# EAGLE design stepper_fw_bw_w_input_control (EAGLE 6.4)
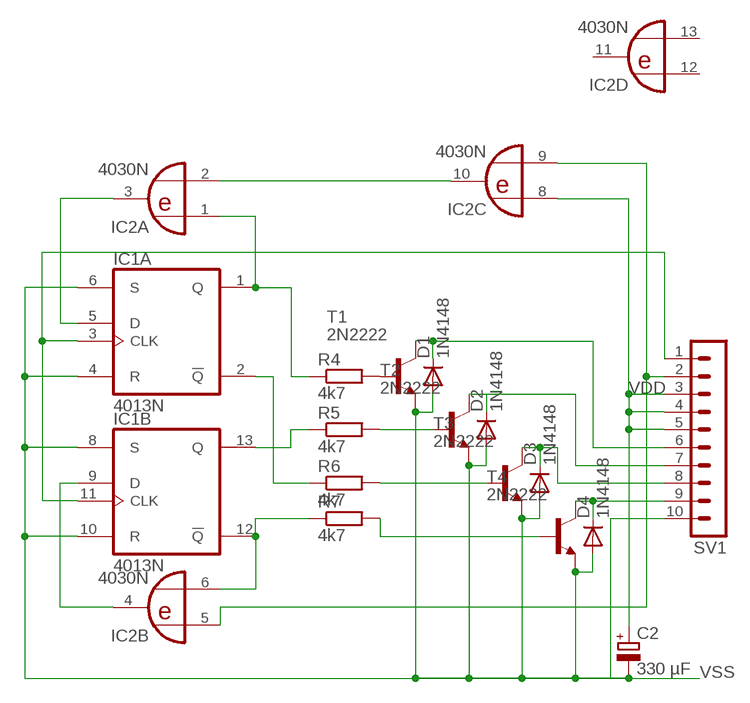
[diagram p0: schematic, sheet 1]

## Parts
C2  330 µF  CPOL-EUE2.5-5  [E2,5-5]
D1  1N4148  DIODE-D-2.5  [D-2.5]
D2  1N4148  DIODE-D-2.5  [D-2.5]
D3  1N4148  DIODE-D-2.5  [D-2.5]
D4  1N4148  DIODE-D-2.5  [D-2.5]
IC1  4013N  [DIL14]
IC2  4030N  [DIL14]
R4  4k7  R-EU_0207/10  [0207/10]
R5  4k7  R-EU_0207/10  [0207/10]
R6  4k7  R-EU_0207/10  [0207/10]
R7  4k7  R-EU_0207/10  [0207/10]
SV1  MA10-1  [MA10-1]
T1  2N2222  [TO18]
T2  2N2222  [TO18]
T3  2N2222  [TO18]
T4  2N2222  [TO18]

## Nets
A1: D2.C SV1.7 T2.3(C)
A2: D1.C SV1.6 T1.3(C)
A3: D3.C SV1.8 T3.3(C)
A4: D4.C SV1.9 T4.3(C)
DIRECTION: IC2.5(B:I0) IC2.9(C:I1) SV1.2
N$1: IC1.1(A:Q) IC2.1(A:I0) R4.1
N$2: IC2.2(A:I1) IC2.10(C:O)
N$3: IC1.2(A:!Q) R6.1
N$4: IC1.5(A:D) IC2.3(A:O)
N$5: IC1.9(B:D) IC2.4(B:O)
N$6: IC1.12(B:!Q) IC2.6(B:I1) R7.1
N$8: IC1.13(B:Q) R5.1
N$9: R4.2 T1.2(B)
N$10: R5.2 T2.2(B)
N$11: R6.2 T3.2(B)
N$12: R7.2 T4.2(B)
TACT: IC1.3(A:CLK) IC1.11(B:CLK) SV1.1
VDD: C2.+ IC2.8(C:I0) SV1.3 SV1.4 SV1.5
VSS: C2.- D1.A D2.A D3.A D4.A IC1.4(A:R) IC1.6(A:S) IC1.8(B:S) IC1.10(B:R) SV1.10 T1.1(E) T2.1(E) T3.1(E) T4.1(E)
Unconnected: IC2.11(D:O) IC2.12(D:I0) IC2.13(D:I1)

## Power pins joined to a net without a drawn wire
VDD: IC1.14(P:VDD) IC2.14(P:VDD)
VSS: IC1.7(P:VSS) IC2.7(P:VSS)

## Library data of the parts
C2 = rcl:CPOL-EU: POLARIZED CAPACITOR, European symbol
D1-D4 = diode:DIODE-: DIODE
IC1 = 40xx:4013: Dual D FLIP FLOP, set/reset
IC2 = 40xx:4030: Quad XOR
R4-R7 = rcl:R-EU_: RESISTOR, European symbol
SV1 = con-lstb:MA10-1: PIN HEADER; OC_FARNELL: unknown; OC_NEWARK: unknown
T1-T4 = transistor:2N2222: NPN TRANSISTOR

## Board
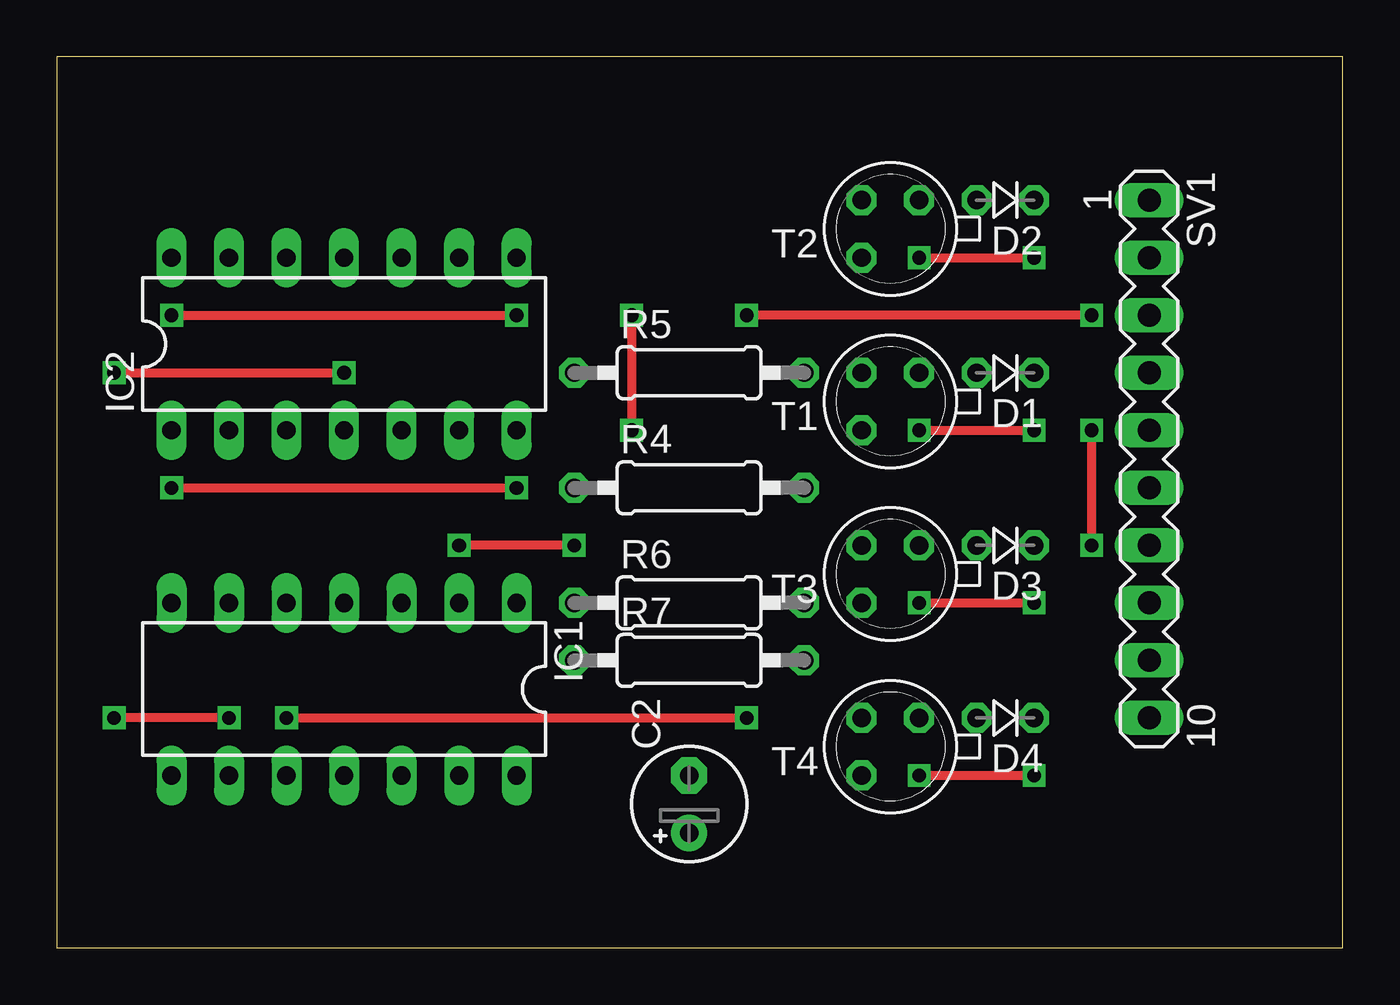
[diagram p1: board, top side]
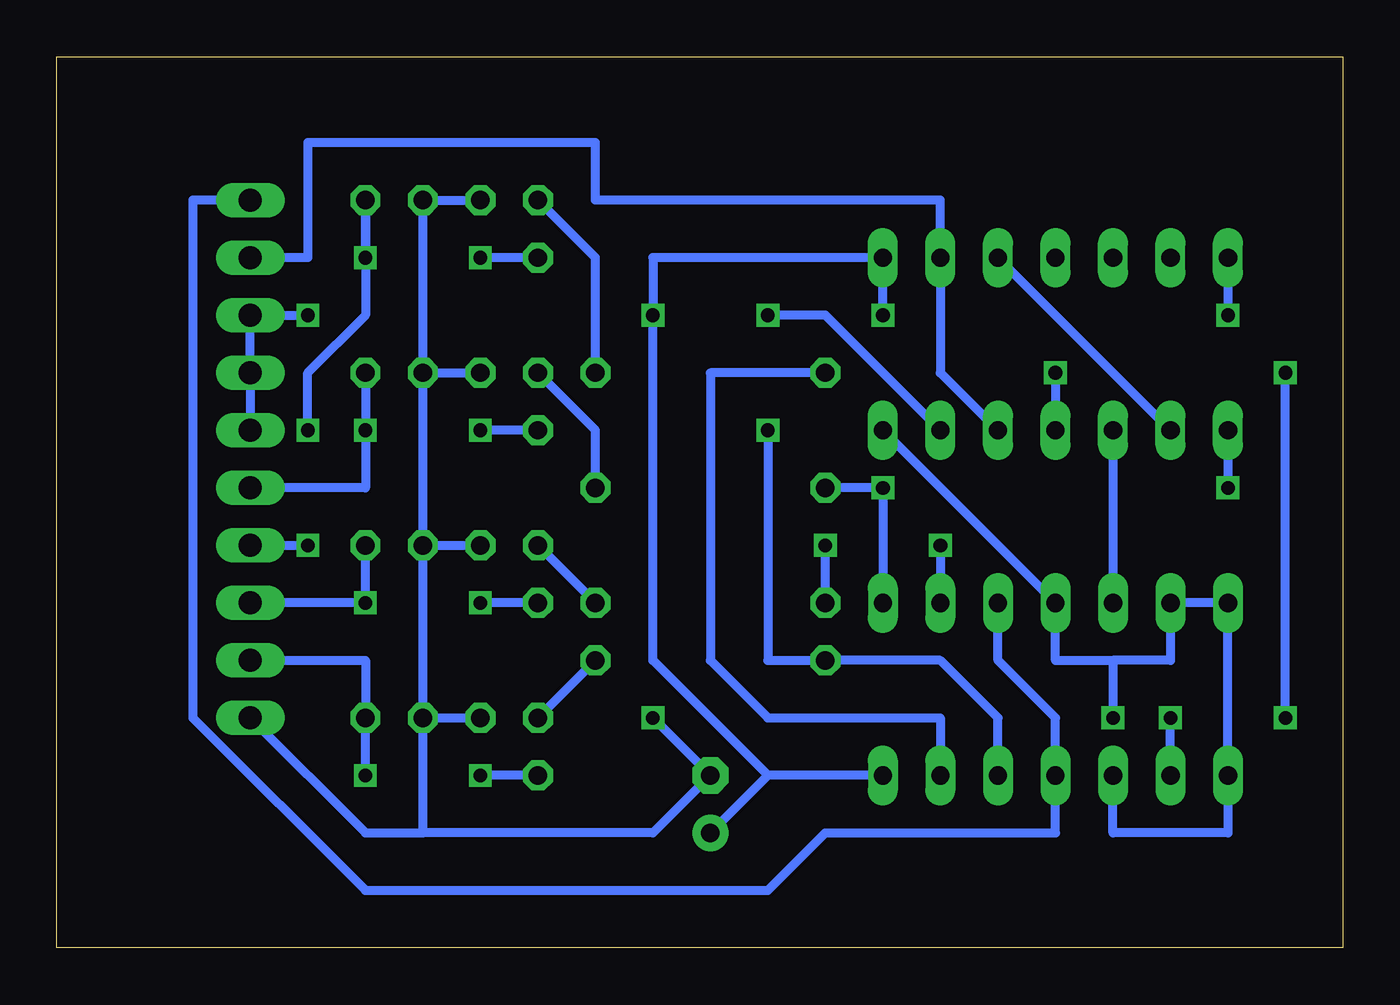
[diagram p2: board, bottom side, seen from below]

Size 56.82 x 39.36 mm. Coordinates in mm from the lower left corner, seen from the top.
Outline: 0,0 56.82,0 56.82,39.36 0,39.36 0,0
Copper layers (1*16): Top 0.035mm / dielectric 1.5mm / Bottom 0.035mm
Design rules "default": minimum track width 10mil, minimum drill 24mil, track to track 8mil, track to pad 8mil, pad to pad 8mil, via to via 8mil, smd to smd 8mil, copper to edge 40mil, drill to drill 8mil, minimum pad ring 10mil, minimum via ring 8mil, stop-mask expansion 4mil, vias tented up to drill 0mil, thermal gap 10mil

### Footprints (pad centres in the part's own frame; a part is rotated, then mirrored left to right if it is on the bottom)
E2,5-5 = drill 0.813 pad 1.6: + -1.27,0 | drill 0.813 pad 1.6 octagon: - 1.27,0
D-2.5 = drill 0.813 octagon: A 1.27,0; C -1.27,0
DIL14 = drill 0.813 long: 1 -7.62,-3.81; 2 -5.08,-3.81; 3 -2.54,-3.81; 4 0,-3.81; 5 2.54,-3.81; 6 5.08,-3.81; 7 7.62,-3.81; 8 7.62,3.81; 9 5.08,3.81; 10 2.54,3.81; 11 0,3.81; 12 -2.54,3.81; 13 -5.08,3.81; 14 -7.62,3.81
0207/10 = drill 0.813 octagon: 1 -5.08,0; 2 5.08,0
MA10-1 = drill 1.016 long: 1 -11.43,0; 2 -8.89,0; 3 -6.35,0; 4 -3.81,0; 5 -1.27,0; 6 1.27,0; 7 3.81,0; 8 6.35,0; 9 8.89,0; 10 11.43,0
TO18 = drill 0.813 octagon: 1 -1.27,-1.27; 2 1.27,-1.27; 3 1.27,1.27

### Placement (x,y rotation side)
C2  27.94,6.35 90 top
D1  41.91,25.4 180 top
D2  41.91,33.02 180 top
D3  41.91,17.78 180 top
D4  41.91,10.16 180 top
IC1  12.7,11.43 180 top
IC2  12.7,26.67 0 top
R4  27.94,20.32 0 top
R5  27.94,25.4 0 top
R6  27.94,15.24 0 top
R7  27.94,12.7 0 top
SV1  48.26,21.59 270 top
T1  36.83,24.13 180 top
T2  36.83,31.75 180 top
T3  36.83,16.51 180 top
T4  36.83,8.89 180 top

### Tracks (layer width: path | path; a pad name or v marks a point on that pad's centre or on a via)
A1  (via drill 0.6)
  Top 0.406: v38.1,30.48 v43.18,30.48 | v45.72,17.78 v45.72,22.86
  Bottom 0.406: T2.3 v38.1,30.48 | v43.18,30.48 D2.C 43.18,27.94 45.72,25.4 v45.72,22.86 | SV1.7 v45.72,17.78
A2  (via drill 0.6)
  Top 0.406: v38.1,22.86 v43.18,22.86
  Bottom 0.406: T1.3 v38.1,22.86 | D1.C v43.18,22.86 43.18,20.32 SV1.6
A3  (via drill 0.6)
  Top 0.406: v38.1,15.24 v43.18,15.24
  Bottom 0.406: T3.3 v38.1,15.24 | D3.C v43.18,15.24 SV1.8
A4  (via drill 0.6)
  Top 0.406: v38.1,7.62 v43.18,7.62
  Bottom 0.406: T4.3 v38.1,7.62 | v43.18,7.62 D4.C 43.18,12.7 SV1.9
DIRECTION
  Bottom 0.406: IC2.5 17.78,25.4 IC2.9 17.78,33.02 33.02,33.02 33.02,35.56 45.72,35.56 45.72,30.48 SV1.2
N$1  (via drill 0.6)
  Top 0.406: v5.08,20.32 v20.32,20.32
  Bottom 0.406: IC2.1 v5.08,20.32 | R4.1 v20.32,20.32 IC1.1
N$2
  Bottom 0.406: IC2.2 IC2.10
N$3  (via drill 0.6)
  Top 0.406: v22.86,17.78 v17.78,17.78
  Bottom 0.406: R6.1 v22.86,17.78 | v17.78,17.78 IC1.2
N$4
  Bottom 0.406: IC2.3 IC1.5
N$5  (via drill 0.6)
  Top 0.406: v7.62,10.16 v2.54,10.16 | v2.54,25.4 v12.7,25.4
  Bottom 0.406: IC1.9 v7.62,10.16 | v2.54,10.16 v2.54,25.4 | v12.7,25.4 IC2.4
N$6  (via drill 0.6)
  Top 0.406: v25.4,27.94 v25.4,22.86
  Bottom 0.406: IC1.12 15.24,10.16 17.78,12.7 R7.1 25.4,12.7 v25.4,22.86 | IC2.6 22.86,27.94 v25.4,27.94
N$8
  Bottom 0.406: R5.1 27.94,25.4 27.94,12.7 25.4,10.16 17.78,10.16 IC1.13
N$9
  Bottom 0.406: R4.2 33.02,22.86 T1.2
N$10
  Bottom 0.406: R5.2 33.02,30.48 T2.2
N$11
  Bottom 0.406: R6.2 T3.2
N$12
  Bottom 0.406: R7.2 T4.2
TACT
  Bottom 0.406: IC1.3 15.24,12.7 12.7,10.16 IC1.11 12.7,5.08 22.86,5.08 25.4,2.54 43.18,2.54 50.8,10.16 50.8,33.02 SV1.1
VDD  (via drill 0.6)
  Top 0.406: v5.08,27.94 v20.32,27.94 | v45.72,27.94 v30.48,27.94
  Bottom 0.406: SV1.5 SV1.4 SV1.3 v45.72,27.94 | IC2.14 v5.08,27.94 | v20.32,27.94 IC2.8 30.48,30.48 v30.48,27.94 30.48,12.7 25.4,7.62 | IC1.14 25.4,7.62 | C2.+ 25.4,7.62
VSS  (via drill 0.6)
  Top 0.406: v10.16,10.16 v30.48,10.16
  Bottom 0.406: 40.64,5.08 30.48,5.08 C2.- v30.48,10.16 | 40.64,5.08 D4.A | D4.A D3.A | D3.A D1.A | D1.A D2.A T2.1 | D1.A T1.1 | D3.A T3.1 | D4.A T4.1 | 40.64,5.08 43.18,5.08 SV1.10 | IC1.10 10.16,5.08 5.08,5.08 IC1.8 IC1.7 IC1.6 7.62,12.7 10.16,12.7 | IC2.7 IC1.4 12.7,12.7 10.16,12.7 | 10.16,12.7 v10.16,10.16

### Text on the board
tValues: Step | Dir | VDD | 15V | A1 | A2 | A3 | A4 | VSS